# Altium schematic sheet Regulador.SchDoc: CONTROLADORA AIRPOPCORN
size A3; DocumentNumber: 2; SheetNumber: 2; SheetTotal: 15
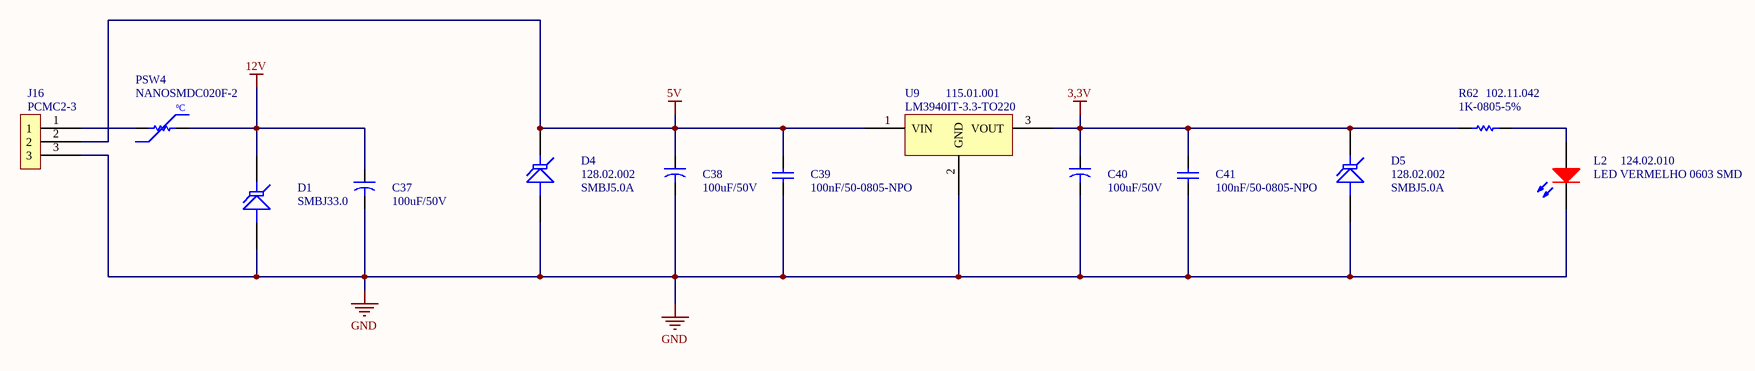
[diagram p0: Regulador.SchDoc]

## Parts
C37  100uF/50V  [CAP POL 8x12mm]
C38  100uF/50V  [CAP POL 8x12mm]
C39  100nF/50-0805-NPO  [0805-REVISADO ONDA]
C40  100uF/50V  [CAP POL 8x12mm]
C41  100nF/50-0805-NPO  [0805-REVISADO ONDA]
D1  SMBJ33.0  [SMB/DO214AA-REVISADO ONDA]
D4  SMBJ5.0A  ERP: 128.02.002  [SMB/DO214AA-REVISADO ONDA]
D5  SMBJ5.0A  ERP: 128.02.002  [SMB/DO214AA-REVISADO ONDA]
J16  PCMC2-3  [CONECTOR HYLOCK 3 VIAS]
L2  LED VERMELHO 0603 SMD  ERP: 124.02.010  [LED 0805 - REVISADO ONDA]
PSW4  NANOSMDC020F-2  [1206-REVISADO ONDA]
R62  1K-0805-5%  ERP: 102.11.042  [0805-REVISADO ONDA]
U9  LM3940IT-3.3-TO220  ERP: 115.01.001  [TO-263]

## Nets
3,3V: C40.1 C41.2 D5.2(K) R62.1 U9.3(VOUT)
5V: C38.1 C39.2 D4.2(K) J16.2 U9.1(VIN)
12V: C37.1 D1.2(K) PSW4.2
GND: C37.2 C38.2 C39.1 C40.2 C41.1 D1.1(A) D4.1(A) D5.1(A) J16.3 L2.2(K) U9.2(GND)
NetJ16_1: J16.1 PSW4.1
NetL2_1: L2.1(A) R62.2

## Notes on the sheet
- NOME
- DATA
- PROJETO
- DESCRIÇÃO
- desenho
- verif.
- aprov.
- TAMANHO
- CODIGO
- Todas as informações disponíveis
- não devem ser divulgadas,
- em parte ou todo.
- CIRCUITO IMPRESSO
- MONTAGEM ELETRÔNICA
- A4
- de
- (in symbol POLYSWITCH 200mA) ºC

## Library data of the parts
D1 = SMBJ5.0A: ERP: 128.02.002
PSW4 = POLYSWITCH 200mA: ERP: 128.12.002
C37 C38 C40 = 100uF/50V: ERP: 105.01.003
C39 C41 = 100nF/50-0805-NPO: ERP: 104.11.005